# Altium schematic sheet [02] - BLOCK DIAGRAM.SchDoc
size A2; DocumentNumber: 2; SheetNumber: 2; SheetTotal: 20; PageSetup: Record=PageOptions|CenterHorizontal=True|CenterVertical=True|PrintScale=0.73|XCorrection=1.00|YCorrection=1.00|PrintKind=0|BorderSize=5000000|LeftOffset=0|BottomOffset=0|Orientation=2|PaperLength=1000|PaperWidth=1000|Scale=100|PaperSource=7|PrintQuality=-4|MediaType=1|DitherType=10|PaperKind=A3|PrintScaleMode=1
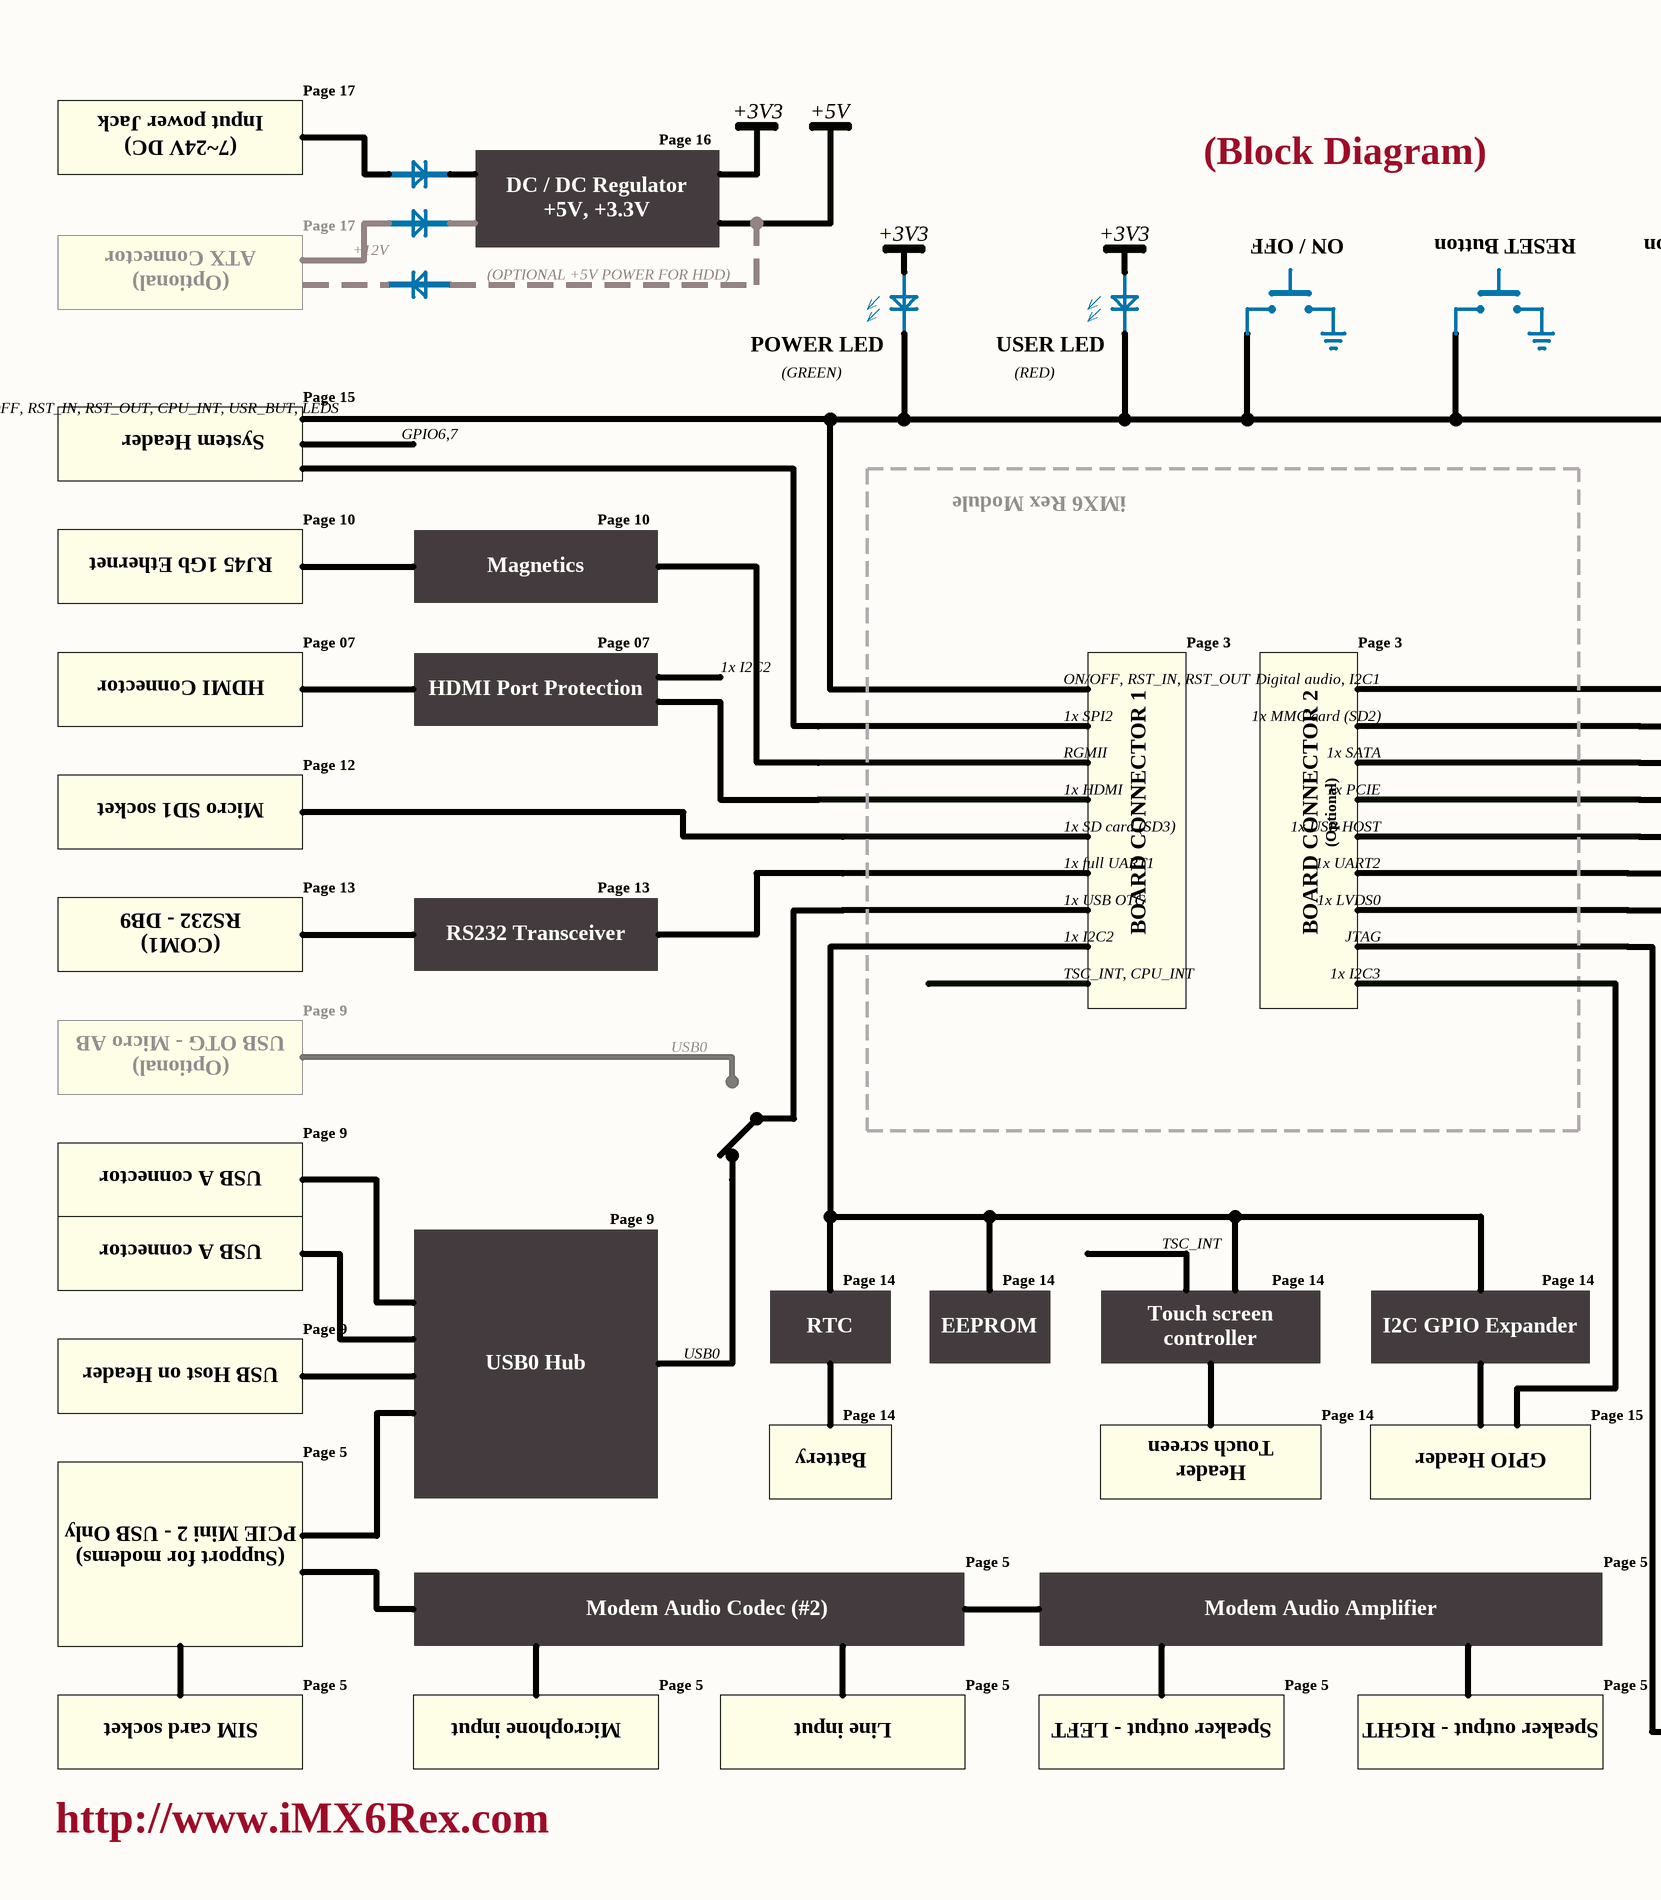
[diagram p0: [02] - BLOCK DIAGRAM.SchDoc, left]
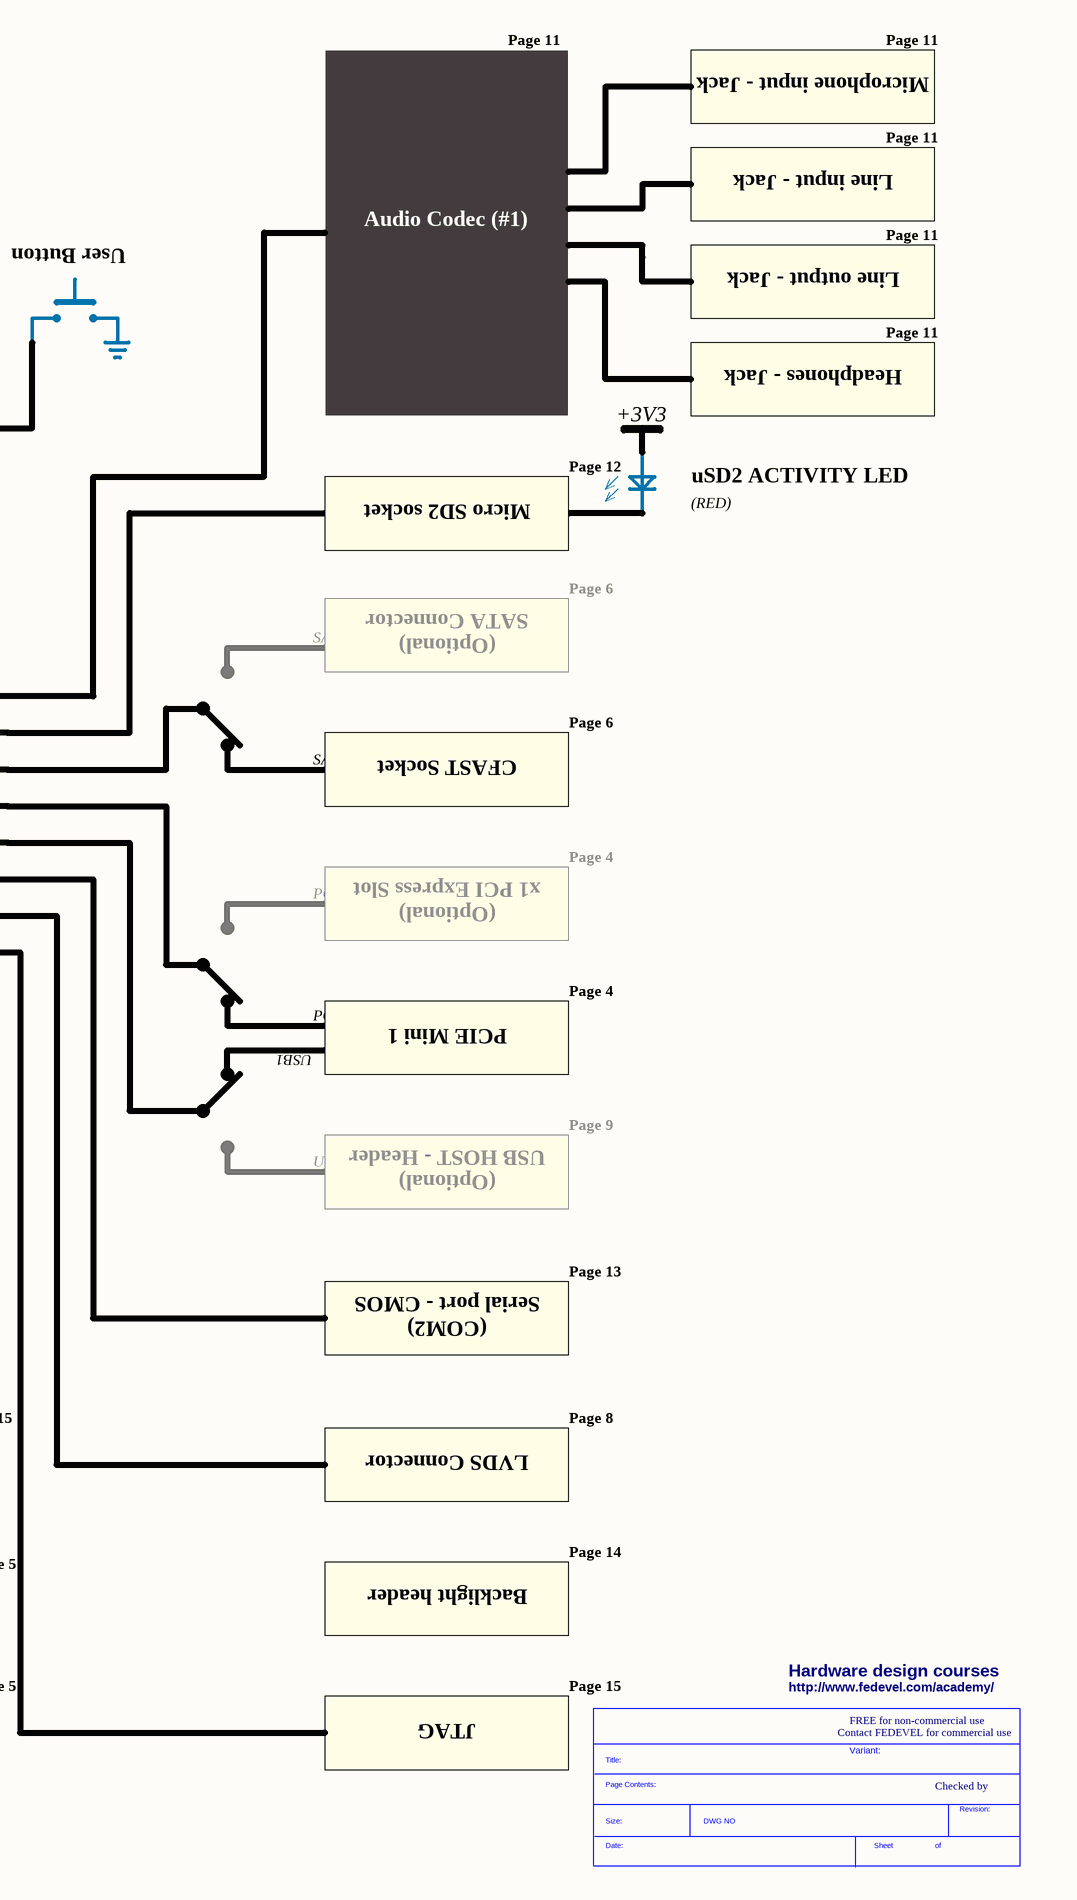
[diagram p1: [02] - BLOCK DIAGRAM.SchDoc, right]

## Parts
*  SDTitleBlock  (value not drawn)  (graphical)

## Notes on the sheet
- Page 11
- Microphone input - Jack
- Input power Jack
- Page 17
- Page 16
- +3V3
- +5V
- (7~24V DC)
- DC / DC Regulator
- (Block Diagram)
- Line input - Jack
- ATX Connector
- +12V
- +5V, +3.3V
- ON / OFF
- RESET Button
- User Button
- Audio Codec (#1)
- (Optional)
- (OPTIONAL +5V POWER FOR HDD)
- Line output - Jack
- (GREEN)
- POWER LED
- (RED)
- USER LED
- Headphones - Jack
- System Header
- Page 15
- ON/OFF, RST_IN, RST_OUT, CPU_INT, USR_BUT, LEDS
- GPIO6,7
- iMX6 Rex Module
- Micro SD2 socket
- Page 12
- uSD2 ACTIVITY LED
- RJ45 1Gb Ethernet
- Page 10
- Magnetics
- SATA
- SATA Connector
- Page 6
- HDMI Connector
- Page 07
- HDMI Port Protection
- 1x I2C2
- ON/OFF, RST_IN, RST_OUT
- Page 3
- Digital audio, I2C1
- RGMII
- 1x SPI2
- 1x SATA
- 1x MMC card (SD2)
- Micro SD1 socket
- 1x HDMI
- BOARD CONNECTOR 1
- BOARD CONNECTOR 2
- 1x PCIE
- CFAST Socket
- 1x SD card (SD3)
- 1x full UART1
- 1x USB HOST
- 1x UART2
- Page 4
- RS232 - DB9
- Page 13
- RS232 Transceiver
- 1x USB OTG
- JTAG
- 1x LVDS0
- PCIE
- x1 PCI Express Slot
- (COM1)
- TSC_INT, CPU_INT
- 1x I2C3
- USB OTG - Micro AB
- Page 9
- USB0
- USB1
- PCIE Mini 1
- USB A connector
- USB HOST - Header
- TSC_INT
- Page 14
- Serial port - CMOS
- USB0 Hub
- RTC
- EEPROM
- Touch screen
- controller
- I2C GPIO Expander
- (COM2)
- USB Host on Header
- Page 8
- Page 5
- Battery
- Header
- GPIO Header
- LVDS Connector
- PCIE Mini 2 - USB Only
- (Support for modems)
- Modem Audio Codec (#2)
- Modem Audio Amplifier
- Backlight header
- Hardware design courses
- SIM card socket
- Microphone input
- Line input
- Speaker output - LEFT
- Speaker output - RIGHT
- (near *) Page 15
- http://www.fedevel.com/academy/
- Contact FEDEVEL for commercial use
- FREE for non-commercial use
- Variant:
- Checked by
- http://www.iMX6Rex.com
- (in symbol SDTitleBlock) Title:; Page Contents:; Revision:; Size:; DWG NO; Date:; Sheet; of